# Altium schematic sheet DM1092_Battery&Alarm.SchDoc: =project_title (part 1 of 3)
size Tabloid; PageSetup: Record=PageOptions|CenterHorizontal=True|CenterVertical=True|PrintScale=0.73|XCorrection=1.00|YCorrection=1.00|PrintKind=0|BorderSize=5000000|LeftOffset=0|BottomOffset=0|Orientation=2|PaperLength=1000|PaperWidth=1000|Scale=100|PaperSource=7|PrintQuality=-4|MediaType=1|DitherType=10|PaperKind=A4|PrintScaleMode=1; CompanyName: Luxonis Holding; Organization: Luxonis Holding; Address1: 1925 Harmony Park Drive; Address2: Westminster, CO; Address3: 80234; Address4: United States; SheetNumber: 3; SheetTotal: 13
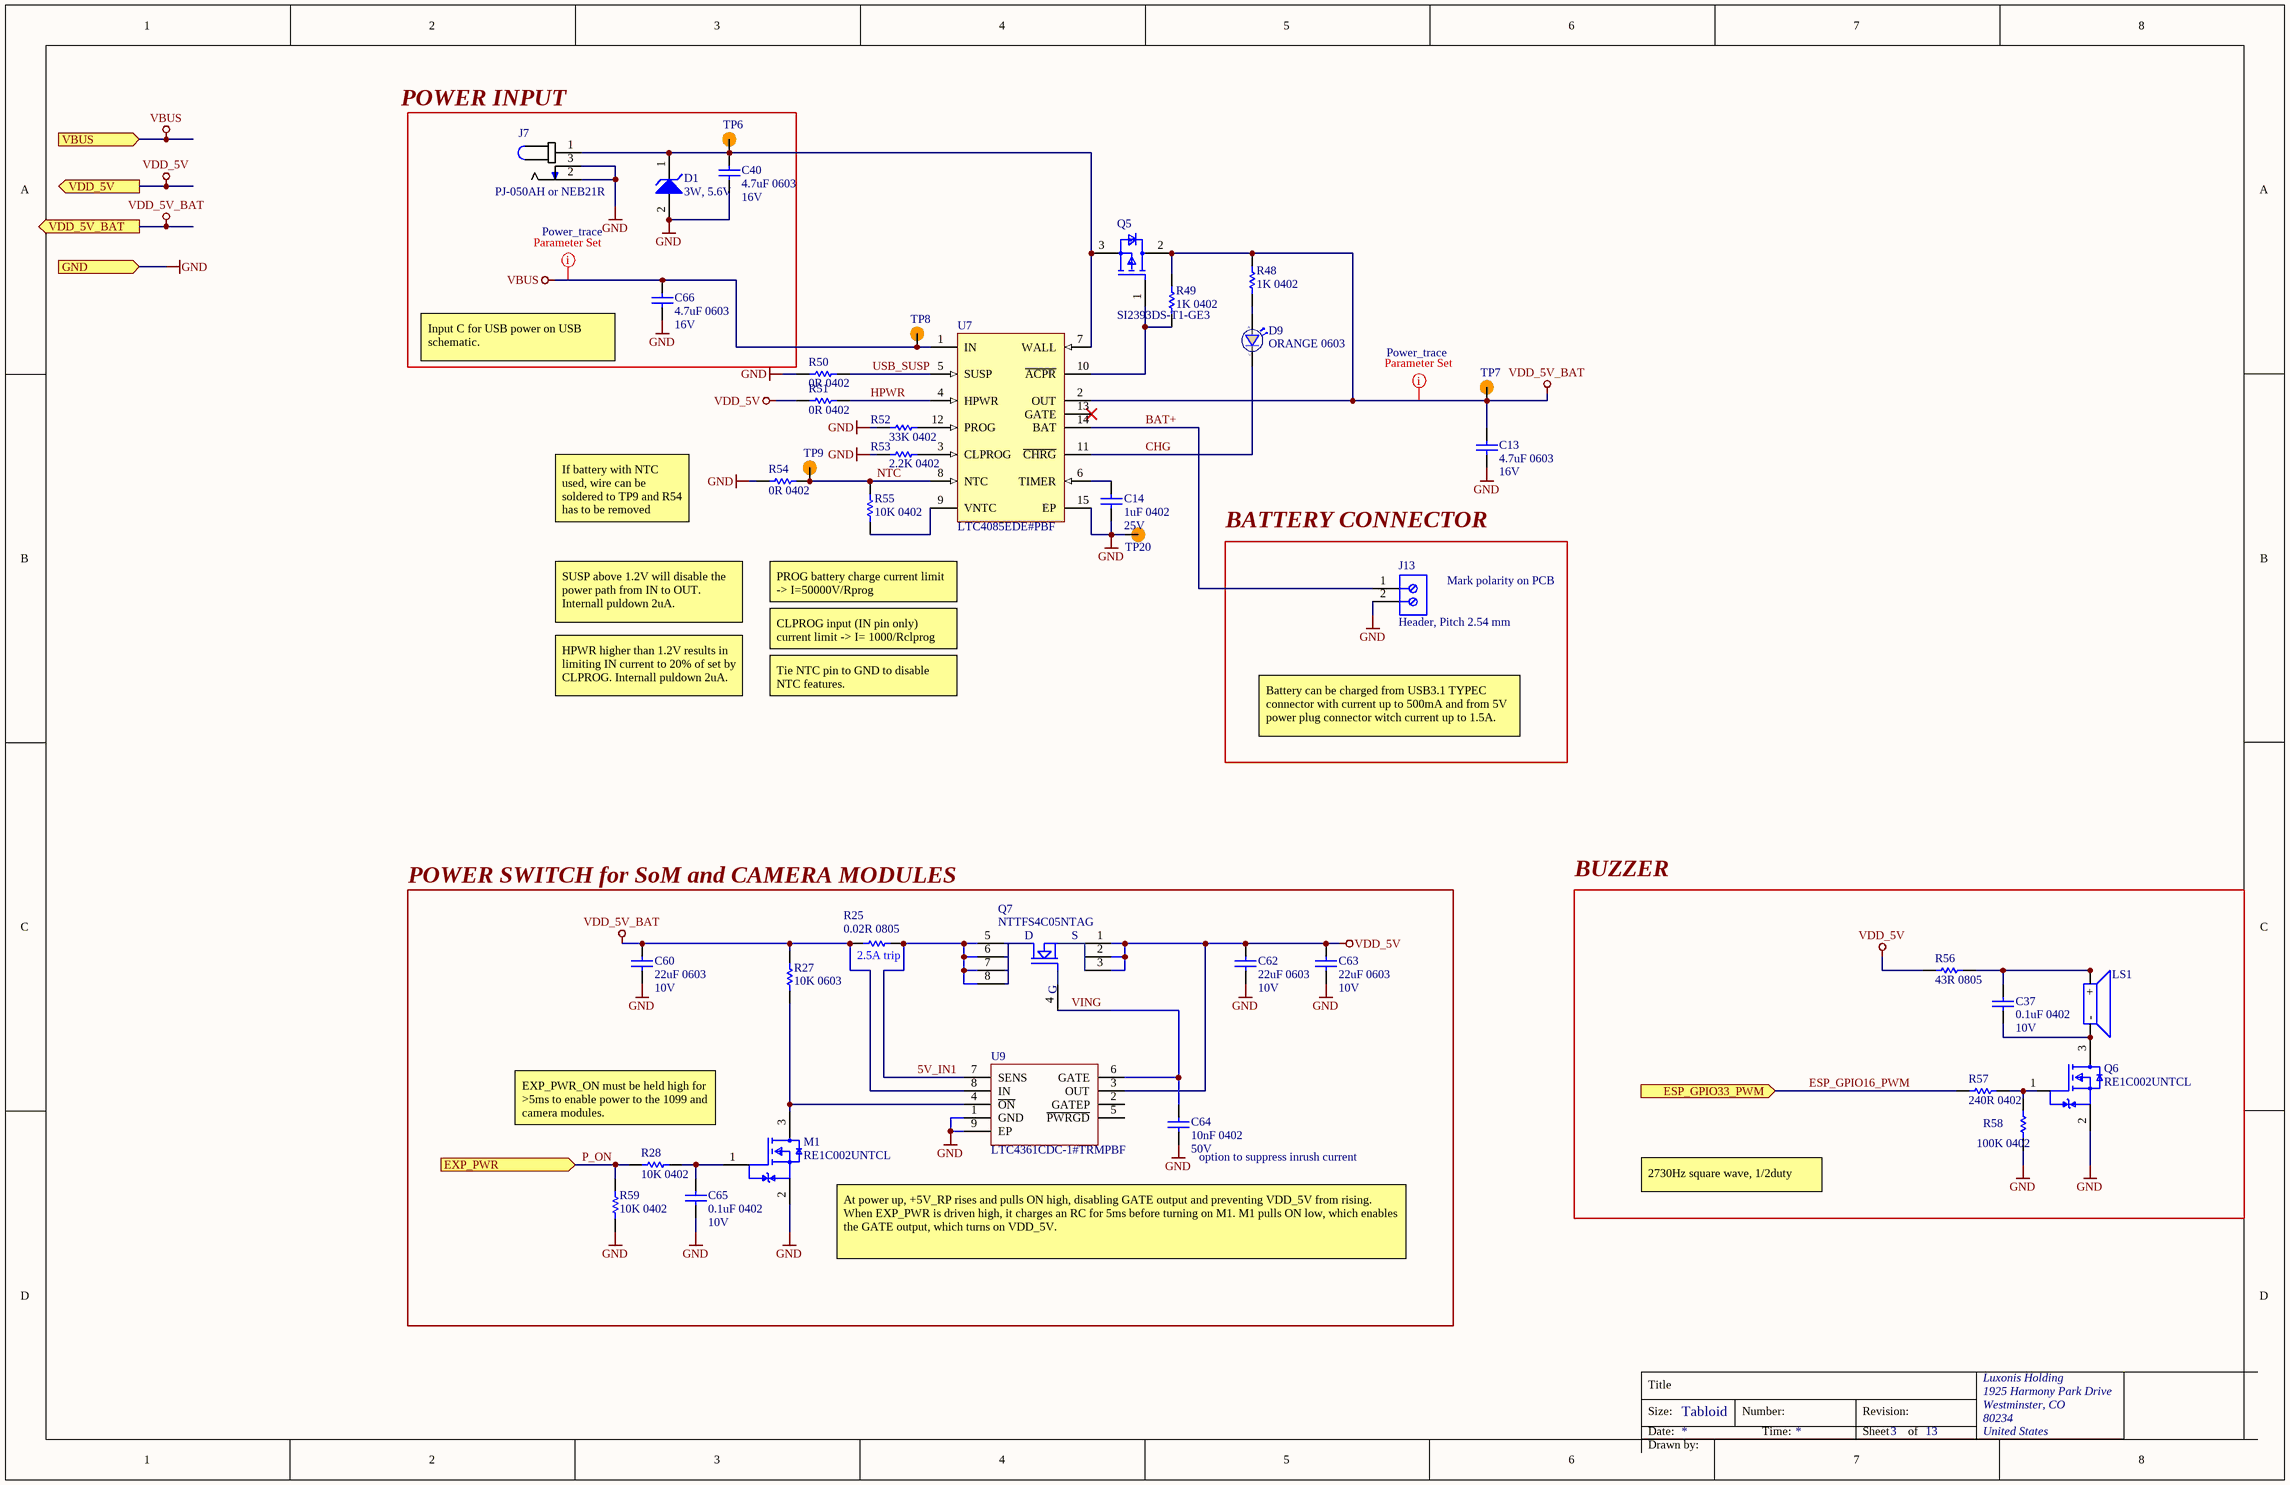
[diagram p0: DM1092_Battery&Alarm.SchDoc]

## Parts
C13  4.7uF 0603  Voltage Rating: 16V  [CAPC0603(1608)100_N]
C14  1uF 0402  Voltage Rating: 25V  [CAPC0402(1005)70_N]
C37  0.1uF 0402  Voltage Rating: 10V  [CAPC0402(1005)70_N]
C40  4.7uF 0603  Voltage Rating: 16V  [CAPC0603(1608)100_N]
C60  22uF 0603  Voltage Rating: 10V  [CAPC0603(1608)100_N]
C62  22uF 0603  Voltage Rating: 10V  [CAPC0603(1608)100_N]
C63  22uF 0603  Voltage Rating: 10V  [CAPC0603(1608)100_N]
C64  10nF 0402  Voltage Rating: 50V  [CAPC0402(1005)60_N]
C65  0.1uF 0402  Voltage Rating: 10V  [CAPC0402(1005)70_N]
C66  4.7uF 0603  Voltage Rating: 16V  [CAPC0603(1608)100_N]
D1  3W, 5.6V  [1SMB5919BT3G]
D9  ORANGE 0603  [SML_D1xx8W]
J7  PJ-050AH or NEB21R  [PJ-050AH/NEB21R_COMBO]
J13  Header, Pitch 2.54 mm  [PHOE-1725656-2]
LS1  KSSGJ4B20  [KSSGJ4B20]  (value not drawn)
M1  RE1C002UNTCL  [RE1C002UNTCL]
Q5  SI2393DS-T1-GE3  [FP-S-03946-MFG]
Q6  RE1C002UNTCL  [RE1C002UNTCL]
Q7  NTTFS4C05NTAG  [NTTFS4C05NTAG]
R25  0.02R 0805  [RESC0805(2012)_N]
R27  10K 0603  [RESC0603(1608)_N]
R28  10K 0402  [RESC0402(1005)_L]
R48  1K 0402  [RESC0402(1005)_N]
R49  1K 0402  [RESC0402(1005)_N]
R50  0R 0402  [RESC0402(1005)_L]
R51  0R 0402  [RESC0402(1005)_L]
R52  33K 0402  [RESC0402(1005)_L]
R53  2.2K 0402  [RESC0402(1005)_N]
R54  0R 0402  [RESC0402(1005)_L]
R55  10K 0402  [RESC0402(1005)_N]
R56  43R 0805  [RESC0805(2012)_N]
R57  240R 0402  [RESC0402(1005)_N]
R58  100K 0402  [RESC0402(1005)_L]
R59  10K 0402  [RESC0402(1005)_L]
TP6  TP100_200_NS  [TP100_200_NS]  (value not drawn)  (no BOM)
TP7  TP100_200_NS  [TP100_200_NS]  (value not drawn)  (no BOM)
TP8  TP100_200_NS  [TP100_200_NS]  (value not drawn)  (no BOM)
TP9  TP100_200_NS  [TP100_200_NS]  (value not drawn)  (no BOM)
TP20  TP100_200_NS  [TP100_200_NS]  (value not drawn)  (no BOM)
U7  LTC4085EDE#PBF  [LT-DE-14_V]
U9  LTC4361CDC-1#TRMPBF  [LTC4361CDC-1#TRMPBF]

## Blocks framed on the sheet
BATTERY CONNECTOR: J13
POWER SWITCH for SoM and CAMERA MODULES: C60 C62-C65 M1 Q7 R25 R27 R28 R59 U9
BUZZER: C37 LS1 Q6 R56-R58

## Ports
ESP_GPIO33_PWM (in), EXP_PWR (in), GND (in), VBUS (in), VDD_5V (out), VDD_5V_BAT (out)

## Nets
GND: C13.1 C14.1 C40.1 C60.1 C62.1 C63.1 C64.1 C65.1 C66.1 D1.2(A) J7.2 J7.3 J13.2 M1.2(Source) Q6.2(Source) R50.1 R52.1 R53.1 R54.1 R58.1 R59.1 TP20.1 U7.15(EP) U9.1(GND) U9.9(EP) ; port GND
VBUS: C66.2 TP8.1 U7.1(IN) ; port VBUS
VDD_5V: C62.2 C63.2 Q7.1(S) Q7.2(S) Q7.3(S) R51.1 R56.1 U9.3(OUT) ; port VDD_5V
VDD_5V_BAT: C13.2 C60.2 Q5.2(S) R25.1 R27.2 R48.2 R49.2 TP7.1 U7.2(OUT) U9.8(IN) ; port VDD_5V_BAT
5V_IN1: Q7.5(D) Q7.6(D) Q7.7(D) Q7.8(D) R25.2 U9.7(SENS)
BAT+: J13.1 U7.14(BAT)
CHG: D9.1(C) U7.11(~{CHRG})
ESP_GPIO16_PWM: R57.1 ; port ESP_GPIO33_PWM
HPWR: R51.2 U7.4(HPWR)
NTC: R54.2 R55.2 TP9.1 U7.8(NTC)
P_ON: R28.2 R59.2 ; port EXP_PWR
USB_SUSP: R50.2 U7.5(SUSP)
VING: C64.2 Q7.4(G) U9.6(GATE)
NetC14_2: C14.2 U7.6(TIMER)
NetC37_1: C37.1 LS1.1(+) LS1.4(+) R56.2
NetC37_2: C37.2 LS1.2(-) LS1.3(-) Q6.3(Drain)
NetC40_2: C40.2 D1.1(K) J7.1 Q5.3(D) TP6.1 U7.7(WALL)
NetC65_2: C65.2 M1.1(Gate) R28.1
NetD9_2: D9.2(A) R48.1
NetM1_3: M1.3(Drain) R27.1 U9.4(~{ON})
NetQ5_1: Q5.1(G) R49.1 U7.10(~{ACPR})
NetQ6_1: Q6.1(Gate) R57.2 R58.2
NetR52_2: R52.2 U7.12(PROG)
NetR53_2: R53.2 U7.3(CLPROG)
NetR55_1: R55.1 U7.9(VNTC)

Not connected (* = marked no-connect by the designer): U7 13(GATE)*; U9 2(GATEP) 5(~{PWRGD})

## Layout directives
net class Power_trace: VBUS, VDD_5V_BAT

## Notes on the sheet
- (near J7) POWER INPUT
- (near C66) Input C for USB power on USB schematic.
- If battery with NTC used, wire can be soldered to TP9 and R54 has to be removed
- SUSP above 1.2V will disable the power path from IN to OUT.
  Internall puldown 2uA.
- PROG battery charge current limit -> I=50000V/Rprog
- (near J13) Mark polarity on PCB
- HPWR higher than 1.2V results in limiting IN current to 20% of set by CLPROG. Internall puldown 2uA.
- Tie NTC pin to GND to disable NTC features.
- CLPROG input (IN pin only) current limit -> I= 1000/Rclprog
- Battery can be charged from USB3.1 TYPEC connector with current up to 500mA and from 5V power plug connector witch current up to 1.5A.
- (near R25) 2.5A trip
- EXP_PWR_ON must be held high for >5ms to enable power to the 1099 and camera modules.
- (near C64) option to suppress inrush current
- 2730Hz square wave, 1/2duty
- At power up, +5V_RP rises and pulls ON high, disabling GATE output and preventing VDD_5V from rising. When EXP_PWR is driven high, it charges an RC for 5ms before turning on M1. M1 pulls ON low, which enables the GATE output, which turns on VDD_5V.
- Title
- Size:
- Date:
- Tabloid
- Number:
- Time:
- Revision:
- Sheet
- of
- Drawn by: